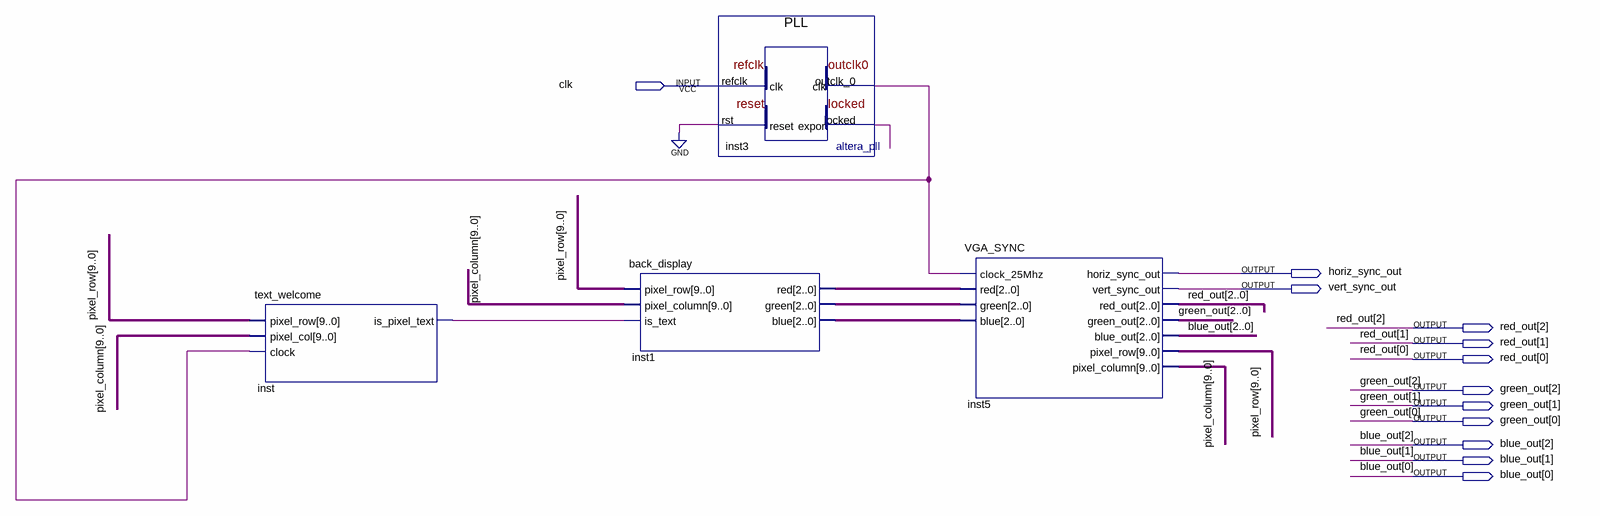
[diagram p0: schematic sheet]
// Quartus schematic welcome-display.bdf as structural Verilog: 4 symbols, 12 pins
module \welcome-display  (
  input  clk,
  output horiz_sync_out,
  output vert_sync_out,
  output [2:0] red_out,
  output [2:0] green_out,
  output [2:0] blue_out
);

  wire inst3_locked, inst3_outclk_0, inst_is_pixel_text;
  wire [2:0] inst1_blue, inst1_green, inst1_red;
  wire [9:0] pixel_column, pixel_row;

  text_welcome inst (
    .pixel_row(pixel_row), .pixel_col(pixel_column), .clock(inst3_outclk_0),
    .is_pixel_text(inst_is_pixel_text));
  back_display inst1 (
    .pixel_row(pixel_row), .pixel_column(pixel_column), .is_text(inst_is_pixel_text), .red(inst1_red),
    .green(inst1_green), .blue(inst1_blue));
  PLL inst3 (.refclk(clk), .rst(1'b0), .outclk_0(inst3_outclk_0), .locked(inst3_locked));
  VGA_SYNC inst5 (
    .clock_25Mhz(inst3_outclk_0), .red(inst1_red), .green(inst1_green), .blue(inst1_blue),
    .horiz_sync_out(horiz_sync_out), .vert_sync_out(vert_sync_out), .red_out(red_out), .green_out(green_out),
    .blue_out(blue_out), .pixel_row(pixel_row), .pixel_column(pixel_column));
endmodule
